# Altium schematic sheet Sensors.SchDoc
size A4; SheetNumber: 1; SheetTotal: 6
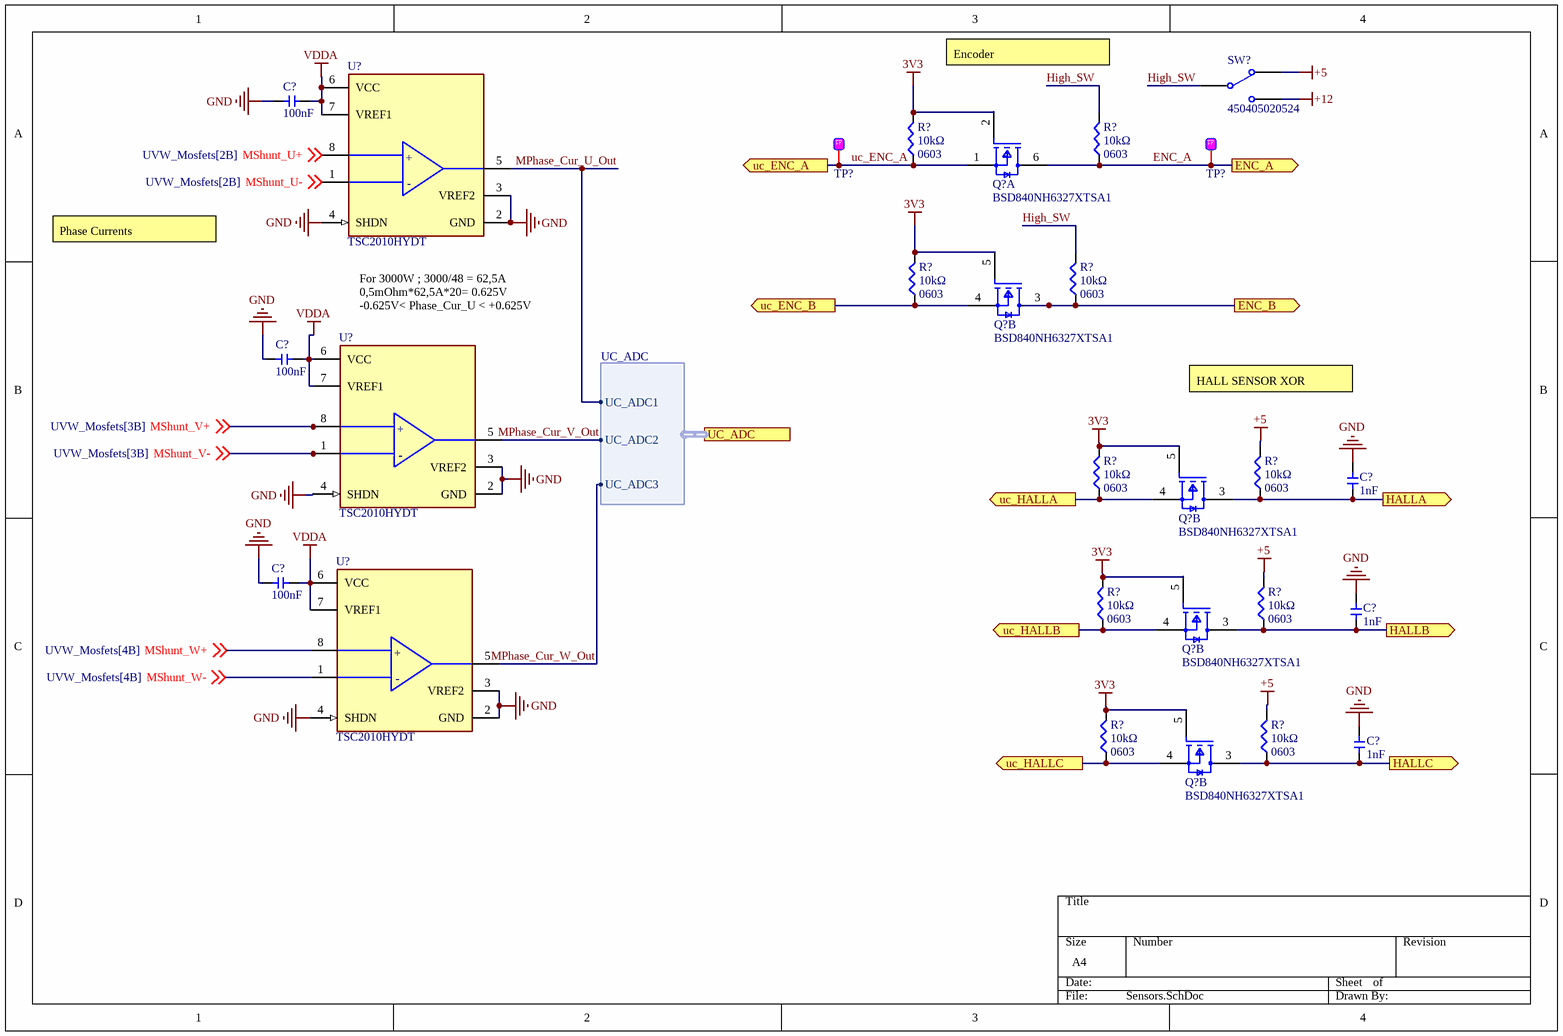
[diagram p0: Sensors.SchDoc]

## Parts
(Parts that share a designator on the sheet are numbered #1, #2 ... from top to bottom, then left to right.)
C?#1  value 100nF  [0603_cap]  (hidden comment: 0603_100nF)
C?#2  value 100nF  [0603_cap]  (hidden comment: 0603_100nF)
C?#3  value 1nF  [0603_cap]  (hidden comment: 0603_1nF)
C?#4  value 100nF  [0603_cap]  (hidden comment: 0603_100nF)
C?#5  value 1nF  [0603_cap]  (hidden comment: 0603_1nF)
C?#6  value 1nF  [0603_cap]  (hidden comment: 0603_1nF)
Q?#1  BSD840NH6327XTSA1  [FP-PG-SOT363-6-IPC_A]  (part A of 2)
Q?#2  BSD840NH6327XTSA1  [FP-PG-SOT363-6-IPC_A]  (part B of 2)
Q?#3  BSD840NH6327XTSA1  [FP-PG-SOT363-6-IPC_A]  (part B of 2)
Q?#4  BSD840NH6327XTSA1  [FP-PG-SOT363-6-IPC_A]  (part B of 2)
Q?#5  BSD840NH6327XTSA1  [FP-PG-SOT363-6-IPC_A]  (part B of 2)
R?#1  value 10kΩ  Package: 0603  [0603-smd]  (hidden comment: 0603_10K)
R?#2  value 10kΩ  Package: 0603  [0603-smd]  (hidden comment: 0603_10K)
R?#3  value 10kΩ  Package: 0603  [0603-smd]  (hidden comment: 0603_10K)
R?#4  value 10kΩ  Package: 0603  [0603-smd]  (hidden comment: 0603_10K)
R?#5  value 10kΩ  Package: 0603  [0603-smd]  (hidden comment: 0603_10K)
R?#6  value 10kΩ  Package: 0603  [0603-smd]  (hidden comment: 0603_10K)
R?#7  value 10kΩ  Package: 0603  [0603-smd]  (hidden comment: 0603_10K)
R?#8  value 10kΩ  Package: 0603  [0603-smd]  (hidden comment: 0603_10K)
R?#9  value 10kΩ  Package: 0603  [0603-smd]  (hidden comment: 0603_10K)
R?#10  value 10kΩ  Package: 0603  [0603-smd]  (hidden comment: 0603_10K)
SW?  450405020524  [450405020524]
TP?#1  Test Point  [test_point]  (value not drawn)
TP?#2  Test Point  [test_point]  (value not drawn)
U?#1  TSC2010HYDT  [FP-SO8-IPC_A]
U?#2  TSC2010HYDT  [FP-SO8-IPC_A]
U?#3  TSC2010HYDT  [FP-SO8-IPC_A]

## Ports
ENC_A (out), ENC_B (out), HALLA (out), HALLB (out), HALLC (out), UC_ADC (harness UC_ADC), uc_ENC_A (out), uc_ENC_B (out), uc_HALLA (out), uc_HALLB (out), uc_HALLC (out)

## Harnesses
UC_ADC: UC_ADC1, UC_ADC2, UC_ADC3

## Nets
3V3: Q?#1.2(1_GATE) Q?#2.5(2_GATE) Q?#3.5(2_GATE) Q?#4.5(2_GATE) Q?#5.5(2_GATE) R?#1.2 R?#3.2 R?#5.2 R?#7.2 R?#9.2
+5: R?#6.2 R?#8.2 R?#10.2 SW?.L1
+12: SW?.L2
GND: C?#1.1 C?#2.1 C?#3.1 C?#4.1 C?#5.1 C?#6.1 U?#1.2(GND) U?#1.3(VREF2) U?#1.4(SHDN) U?#2.2(GND) U?#2.3(VREF2) U?#2.4(SHDN) U?#3.2(GND) U?#3.3(VREF2) U?#3.4(SHDN)
VDDA: C?#1.2 C?#2.2 C?#4.2 U?#1.6(VCC) U?#1.7(VREF1) U?#2.6(VCC) U?#2.7(VREF1) U?#3.6(VCC) U?#3.7(VREF1)
ENC_A: Q?#1.6(1_DRAIN) R?#2.1 TP?#2.1 ; port ENC_A
ENC_B: Q?#2.3(2_DRAIN) R?#4.1 ; port ENC_B
HALLA: C?#3.2 Q?#3.3(2_DRAIN) R?#6.1 ; port HALLA
HALLB: C?#5.2 Q?#4.3(2_DRAIN) R?#8.1 ; port HALLB
HALLC: C?#6.2 Q?#5.3(2_DRAIN) R?#10.1 ; port HALLC
High_SW: R?#2.2 R?#4.2 SW?.COM
MPhase_Cur_U_Out: U?#1.5(OUT) ; port UC_ADC.UC_ADC1
MPhase_Cur_V_Out: U?#2.5(OUT) ; port UC_ADC.UC_ADC2
MPhase_Cur_W_Out: U?#3.5(OUT) ; port UC_ADC.UC_ADC3
MShunt_U+: U?#1.8(IN+) ; off-sheet MShunt_U+
MShunt_U-: U?#1.1(IN-) ; off-sheet MShunt_U-
MShunt_V+: U?#2.8(IN+) ; off-sheet MShunt_V+
MShunt_V-: U?#2.1(IN-) ; off-sheet MShunt_V-
MShunt_W+: U?#3.8(IN+) ; off-sheet MShunt_W+
MShunt_W-: U?#3.1(IN-) ; off-sheet MShunt_W-
uc_ENC_A: Q?#1.1(1_SOURCE) R?#1.1 TP?#1.1 ; port uc_ENC_A
uc_ENC_B: Q?#2.4(2_SOURCE) R?#3.1 ; port uc_ENC_B
uc_HALLA: Q?#3.4(2_SOURCE) R?#5.1 ; port uc_HALLA
uc_HALLB: Q?#4.4(2_SOURCE) R?#7.1 ; port uc_HALLB
uc_HALLC: Q?#5.4(2_SOURCE) R?#9.1 ; port uc_HALLC

## Notes on the sheet
- Encoder
- Phase Currents
- (near U?#2) For 3000W ; 3000/48 = 62,5A
  0,5mOhm*62,5A*20= 0.625V
  -0.625V< Phase_Cur_U < +0.625V
- HALL SENSOR XOR
- (in symbol CMP-12131-000017-1) +; -

## Library data of the parts
C?#1 C?#2 C?#4 = 0603_100nF: Volt: V; Package: 0603
C?#3 C?#5 C?#6 = 0603_1nF: Volt: V; Package: 0603
Q?#1-Q?#5 = CMP-32901-000170-1: MOSFET 2N-CH 20V 0.88A SOT363; Input Capacitance: 78pF; Rds On Max: 400mR; Max Power Dissipation: 500mW; Rise Time: 2.2ns; FET Type: 2 N-Channel; Continuous Drain Current (ID): 880mA; Gate to Source Voltage (Vgs): 8V; Halogen Free: Halogen Free; Case/Package: SOT-363-6; Mount: Surface Mount; Packaging: Tape and Reel; Lead Free: Lead Free; Max Operating Temperature: 150°C; Number of Pins: 6; Max Dual Supply Voltage: 20V; Drain to Source Voltage (Vdss): 20V; Min Operating Temperature: -55°C
R?#1-R?#10 = 0603_10K: Power: W
SW? = CMP-03913-107782335-1: 450405020524 WS-SLSU Mini Slide Switch; Insulation Resistance: 100MΩ; Min Operating Temperature: -40°C; RoHS: Compliant; Max Operating Temperature: 85°C; Packaging: Tape and Reel; NexarPartId: 107782335; Contact Plating: Silver
TP?#1 TP?#2 = TP
U?#1-U?#3 = CMP-12131-000017-1: IC CURRENT SENSE 1 CIRCUIT 8SOIC